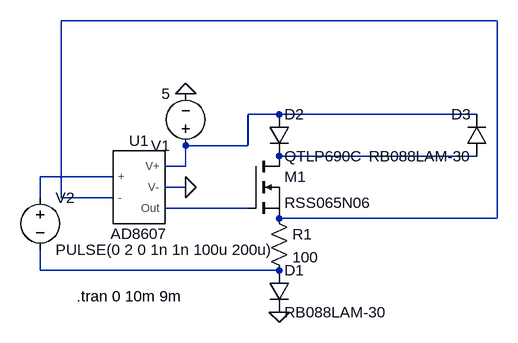
[diagram p0: schematic LED control simulation.asc]
LED control simulation.asc, the LTspice schematic file:
Version 4.1
SHEET 1 880 680
WIRE 800 -96 128 -96
WIRE 464 48 416 48
WIRE 768 48 464 48
WIRE 416 96 416 48
WIRE 416 96 320 96
WIRE 768 112 464 112
WIRE 320 128 320 96
WIRE 320 128 288 128
WIRE 208 144 96 144
WIRE 320 160 288 160
WIRE 96 176 96 144
WIRE 128 176 128 -96
WIRE 208 176 128 176
WIRE 416 192 288 192
WIRE 800 208 800 -96
WIRE 800 208 464 208
WIRE 96 288 96 256
WIRE 464 288 96 288
FLAG 320 16 0
FLAG 464 352 0
FLAG 320 160 0
SYMBOL nmos 416 112 R0
SYMATTR InstName M1
SYMATTR Value RSS065N06
SYMBOL voltage 320 112 R180
WINDOW 123 0 0 Left 0
WINDOW 39 0 0 Left 0
SYMATTR InstName V1
SYMATTR Value 5
SYMBOL diode 448 288 R0
SYMATTR InstName D1
SYMATTR Value RB088LAM-30
SYMATTR Description Diode
SYMATTR Type diode
SYMBOL res 448 192 R0
SYMATTR InstName R1
SYMATTR Value 100
SYMBOL voltage 96 160 R0
WINDOW 123 0 0 Left 0
WINDOW 39 0 0 Left 0
SYMATTR InstName V2
SYMATTR Value PULSE(0 2 0 1n 1n 100u 200u)
SYMBOL diode 784 112 R180
WINDOW 0 24 64 Left 2
WINDOW 3 24 0 Left 2
SYMATTR InstName D3
SYMATTR Value RB088LAM-30
SYMATTR Description Diode
SYMATTR Type diode
SYMBOL AD8607 240 160 R0
SYMATTR InstName U1
SYMBOL diode 448 48 R0
SYMATTR InstName D2
SYMATTR Value QTLP690C
SYMATTR Description Diode
SYMATTR Type diode
TEXT 152 328 Left 2 !.tran 0 10m 9m

The netlist it stands for:
* LED control simulation.asc
M1 N003 N005 N001 N001 RSS065N06
V1 N002 0 5
D1 N006 0 RB088LAM-30
R1 N001 N006 100
V2 N004 N006 PULSE(0 2 0 1n 1n 100u 200u)
D3 N003 N002 RB088LAM-30
X§U1 N004 N001 N002 0 N005 AD8607  ; pins + - V+ V- Out
D2 N002 N003 QTLP690C
.model D D
.lib standard.dio
.model NMOS NMOS
.model PMOS PMOS
.lib standard.mos
.tran 0 10m 9m
.lib C:\Users\Ben\AppData\Local\LTspice\lib\sym\AutoGenerated\ad8607.cir
.backanno
.end